# EAGLE design power_node (EAGLE 6.5.0)
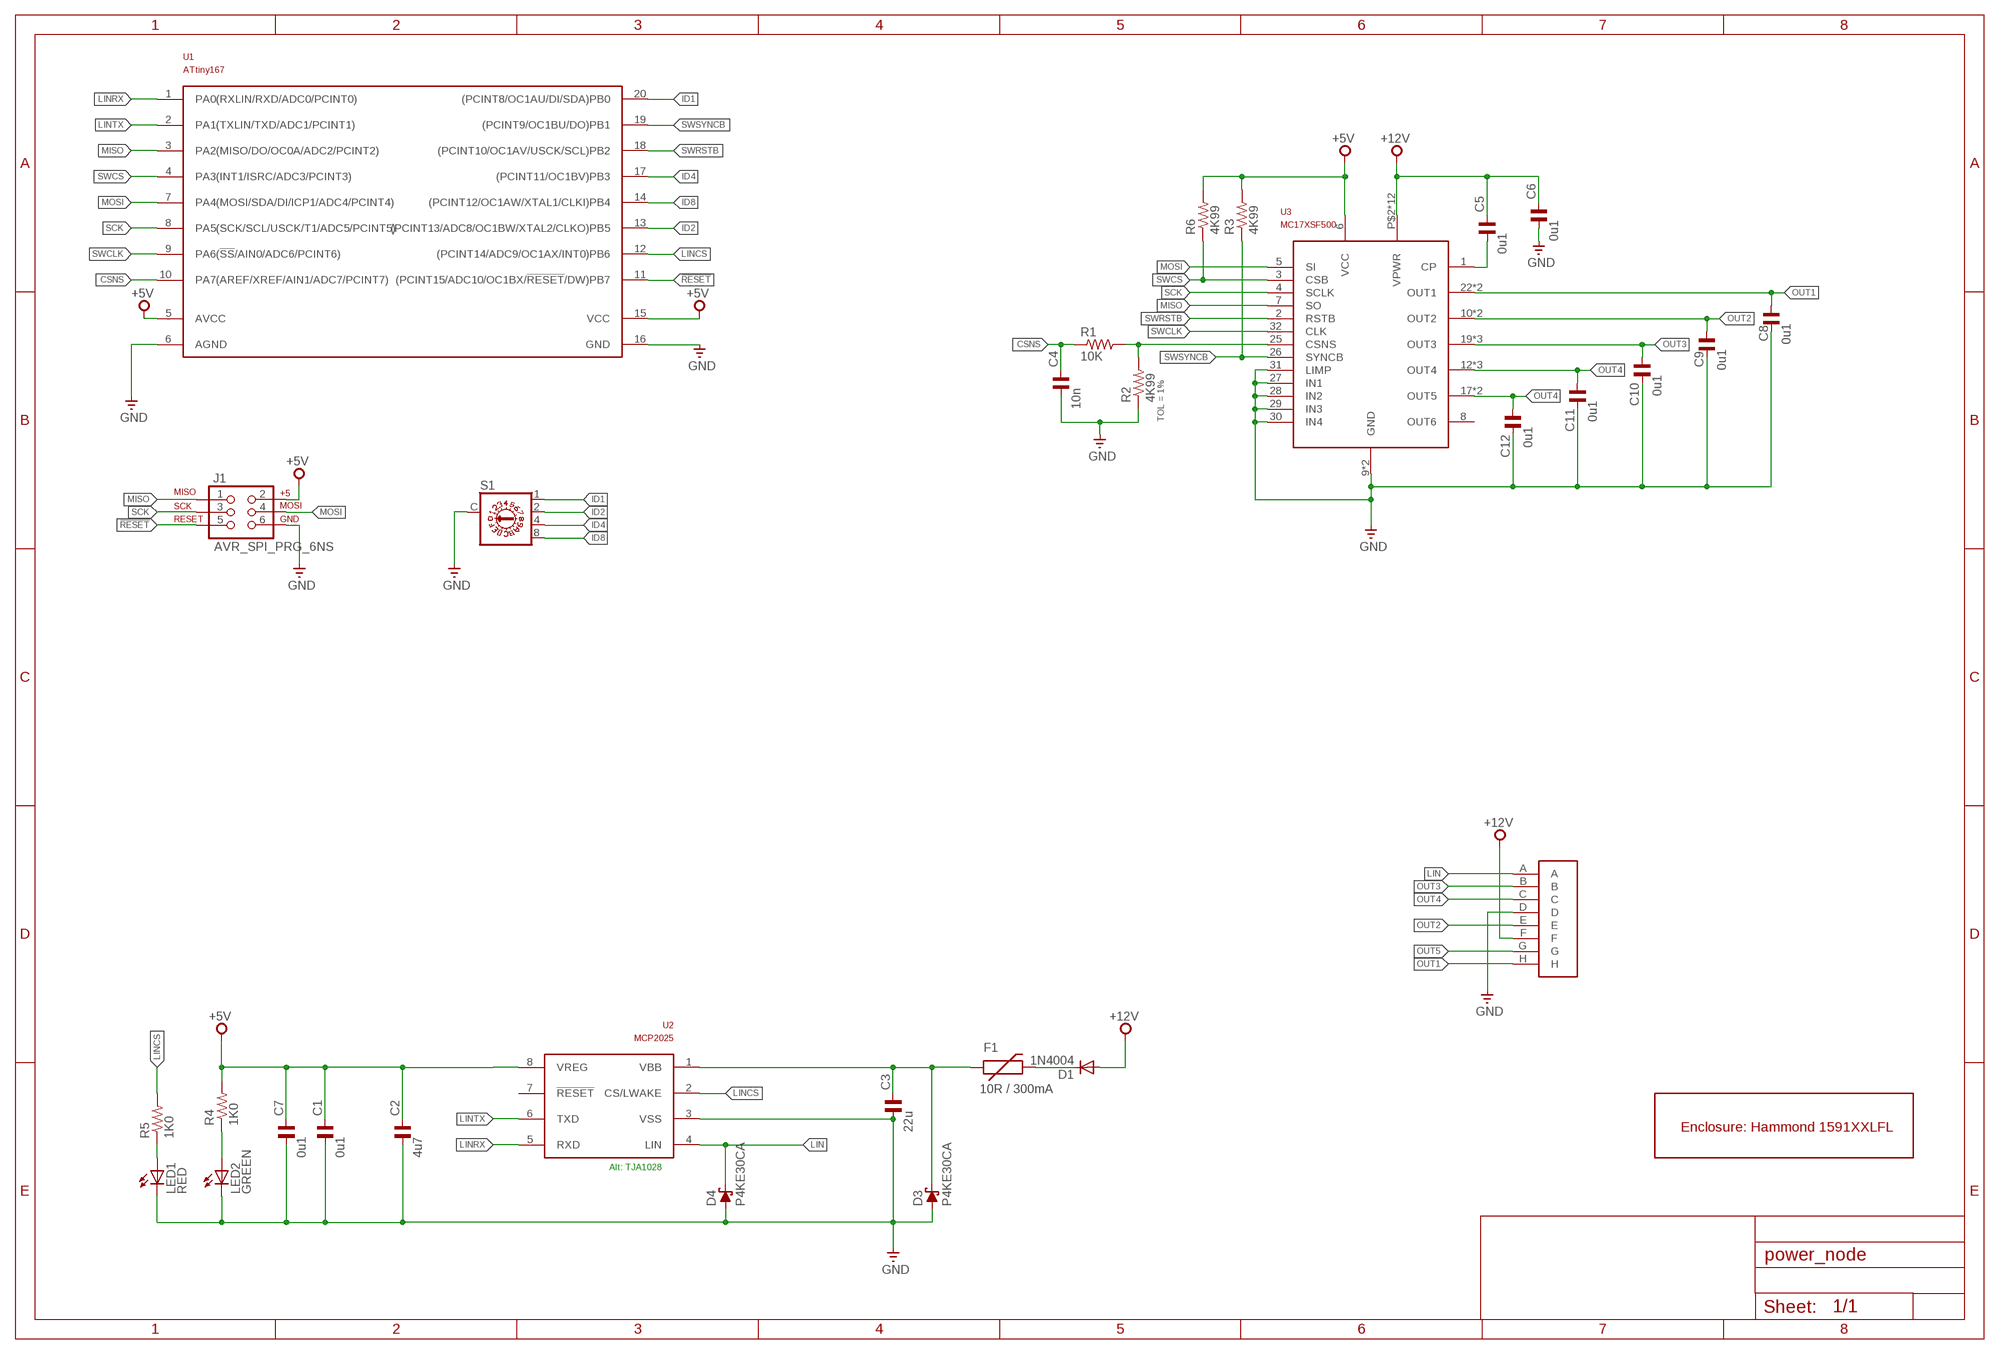
[diagram p0: schematic, sheet 1]

## Parts
C1  0u1  C-EU050-024X044  [C050-024X044]
C2  4u7  C-EU050-024X044  [C050-024X044]
C3  22u  C-EU050-024X044  [C050-024X044]
C4  10n  C-EU025-024X044  [C025-024X044]
C5  0u1  C-EU050-024X044  [C050-024X044]
C6  0u1  C-EU050-024X044  [C050-024X044]
C7  0u1  C-EU050-024X044  [C050-024X044]
C8  0u1  C-EUC0603K  [C0603K]
C9  0u1  C-EUC0603K  [C0603K]
C10  0u1  C-EUC0603K  [C0603K]
C11  0u1  C-EUC0603K  [C0603K]
C12  0u1  C-EUC0603K  [C0603K]
D1  1N4004  [DO41-10]
D3  P4KE30CA  P4KEXX  [DO41-10]
D4  P4KE30CA  P4KEXX  [DO41-10]
F1  10R / 300mA  PTCPTH  [PTC]
J1  AVR_SPI_PRG_6NS  [2X3-NS]
J2  12146734  [12146734]
LED1  RED  LED3MM  [LED3MM]
LED2  GREEN  LED3MM  [LED3MM]
R1  10K  R-EU_0207/10  [0207/10]
R2  4K99  R-EU_0207/10  [0207/10]
R3  4K99  R-EU_0207/10  [0207/10]
R4  1K0  R-EU_0207/10  [0207/10]
R5  1K0  R-EU_0207/10  [0207/10]
R6  4K99  R-EU_0207/10  [0207/10]
S1  P103  [P103]
U1  ATtiny167  ATTINY167  [SO20W]
U2  MCP2025  [SO08]
U3  MC17XSF500  [SOIC32W-EP]
U$1  1591XXLFL  [1591XXLFL]

## Nets
!RESET: J1.5 U1.11((PCINT15/ADC10/OC1BX/!RESET!/DW)PB7)
+5V [power]: C1.1 C2.1 C7.1 J1.2 R3.2 R4.2 R6.2 U1.5(AVCC) U1.15(VCC) U2.8(VREG) U3.6(VCC)
+12V [power]: C5.1 C6.1 D1.A J2.F U3.P$2(VPWR) U3.P$3(VPWR) U3.P$4(VPWR) U3.P$5(VPWR) U3.P$6(VPWR) U3.P$7(VPWR) U3.P$8(VPWR) U3.P$9(VPWR) U3.P$10(VPWR) U3.P$11(VPWR) U3.P$12(VPWR) U3.P$13(VPWR)
CSNS: C4.1 R1.1 U1.10(PA7(AREF/XREF/AIN1/ADC7/PCINT7))
GND [power]: C1.2 C2.2 C3.2 C4.2 C6.2 C7.2 C8.2 C9.2 C10.2 C11.2 C12.2 D3.A D4.A J1.6 J2.D LED1.K(C) LED2.K(C) R2.1 S1.C U1.6(AGND) U1.16(GND) U2.3(VSS) U3.9(GND) U3.24(GND) U3.27(IN1) U3.28(IN2) U3.29(IN3) U3.30(IN4) U3.31(LIMP)
ID1: S1.1 U1.20((PCINT8/OC1AU/DI/SDA)PB0)
ID2: S1.2 U1.13((PCINT13/ADC8/OC1BW/XTAL2/CLKO)PB5)
ID4: S1.4 U1.17((PCINT11/OC1BV)PB3)
ID8: S1.8 U1.14((PCINT12/OC1AW/XTAL1/CLKI)PB4)
LIN: D4.C J2.A U2.4(LIN)
LINCS: R5.2 U1.12((PCINT14/ADC9/OC1AX/INT0)PB6) U2.2(CS/LWAKE)
LINRX: U1.1(PA0(RXLIN/RXD/ADC0/PCINT0)) U2.5(RXD)
LINTX: U1.2(PA1(TXLIN/TXD/ADC1/PCINT1)) U2.6(TXD)
MISO: J1.1 U1.3(PA2(MISO/DO/OC0A/ADC2/PCINT2)) U3.7(SO)
MOSI: J1.4 U1.7(PA4(MOSI/SDA/DI/ICP1/ADC4/PCINT4)) U3.5(SI)
N$1: C5.2 U3.1(CP)
N$2 [power]: C3.1 D3.C F1.P$1 U2.1(VBB)
N$3: LED1.A R5.1
N$4: LED2.A R4.1
N$5 [power]: D1.C F1.P$2
N$6: R1.2 R2.2 U3.25(CSNS)
OUT1: C8.1 J2.H U3.22(OUT1) U3.23(OUT1)
OUT2: C9.1 J2.E U3.10(OUT2) U3.11(OUT2)
OUT3: C10.1 J2.B U3.19(OUT3) U3.20(OUT3) U3.21(OUT3)
OUT4: C11.1 J2.C U3.12(OUT4) U3.13(OUT4) U3.14(OUT4)
OUT5: C12.1 J2.G U3.17(OUT5) U3.18(OUT5)
SCK: J1.3 U1.8(PA5(SCK/SCL/USCK/T1/ADC5/PCINT5)) U3.4(SCLK)
SWCLK: U1.9(PA6(!SS!/AIN0/ADC6/PCINT6)) U3.32(CLK)
SWCS: R6.1 U1.4(PA3(INT1/ISRC/ADC3/PCINT3)) U3.3(CSB)
SWRSTB: U1.18((PCINT10/OC1AV/USCK/SCL)PB2) U3.2(RSTB)
SWSYNCB: R3.1 U1.19((PCINT9/OC1BU/DO)PB1) U3.26(SYNCB)
Unconnected: U2.7(!RESET) U3.8(OUT6)

## Notes on the sheet
- Alt: TJA1028

## Library data of the parts
C1 C5-C7 = custom:C-EU: CAPACITOR, European symbol; PARTNO: FK28X7R1H104K
C2 = custom:C-EU: CAPACITOR, European symbol; PARTNO: FK28X5R0J475K
C3 = custom:C-EU: CAPACITOR, European symbol; PARTNO: FK22X5R1E226M
C4 = custom:C-EU: CAPACITOR, European symbol; PARTNO: FK18X7R1H103K
C8-C12 = custom:C-EU: CAPACITOR, European symbol; PARTNO: C1608X7R1H104M080AA
D1 = custom:1N4004: DIODE general purpose rectifier, 1 A; PARTNO: 1N4004-TP
D3 D4 = custom:P4KEXX: DIODE transient-voltage suppressor; PARTNO: P4KE30CA
F1 = custom:PTC: Resettable Fuse PTC Resettable Fuse. Spark Fun Electronics SKU : COM-08357; PARTNO: CMF-RL10-0
J1 = custom:AVR_SPI_PRG_6: AVR ISP 6 Pin This is the reduced ISP connector for AVR programming. Common on Arduino. This footprint will take up less PCB space and can be used with a 10-pin to 6-pin adapter such as SKU: BOB-08508
J2 = custom:12146734; PARTNO: 12146724-B
LED1 = custom:LED: LEDs Standard schematic elements and footprints for 5mm, 3mm, 1206, and 0603 sized LEDs. 5mm - Spark Fun Electronics SKU : COM-00529 (and others); PARTNO: C4SMF-RJS-CT0W0BB2
LED2 = custom:LED: LEDs Standard schematic elements and footprints for 5mm, 3mm, 1206, and 0603 sized LEDs. 5mm - Spark Fun Electronics SKU : COM-00529 (and others); PARTNO: C4SMF-GJS-CV0Y0792
R1 = custom:R-EU_: RESISTOR, European symbol; PARTNO: CF14JT10K0
R2 = custom:R-EU_: RESISTOR, European symbol; PARTNO: MFR-25FBF52-4K99; TOL: 1%
R3 R6 = custom:R-EU_: RESISTOR, European symbol; PARTNO: MFR-25FBF52-4K99
R4 R5 = custom:R-EU_: RESISTOR, European symbol; PARTNO: CF14JT1K00
S1 = custom:P103: DIL/CODE SWITCH; PARTNO: SH-7050MC
U1 = custom:ATTINY167; PARTNO: ATTINY167-SU
U2 = custom:MCP2025: LIN Transceiver with Voltage Regulator; PARTNO: MCP2025-500E/SN
U3 = custom:MC17XSF500; PARTNO: MC17XSF500EK
U$1 = custom:1591XXLFL; PARTNO: 1591XXLFLBK

## Net classes
0 default: width 0.381 mm
1 power: width 0.635 mm

## Board
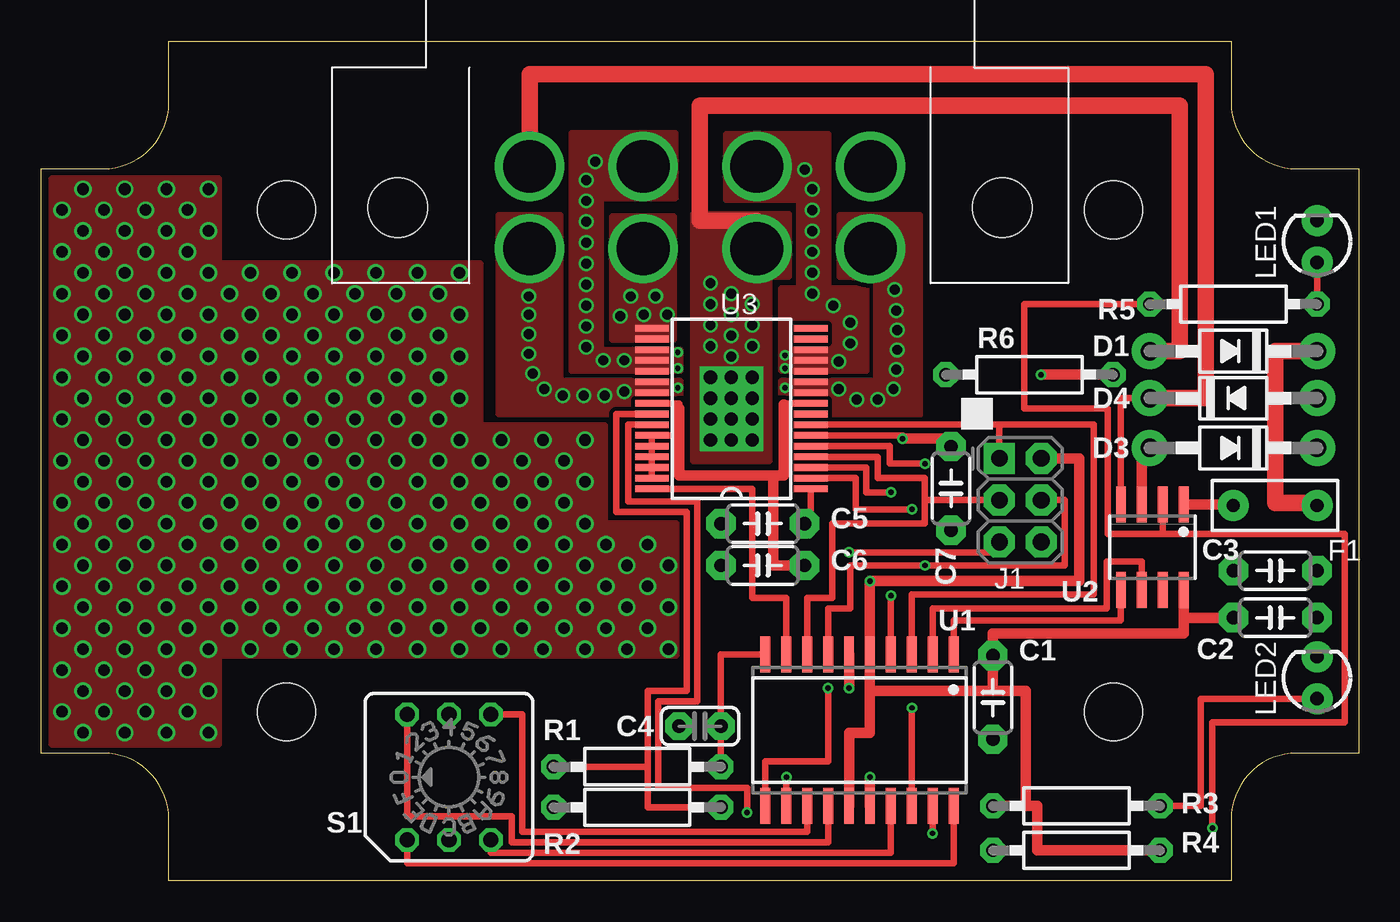
[diagram p1: board, top side]
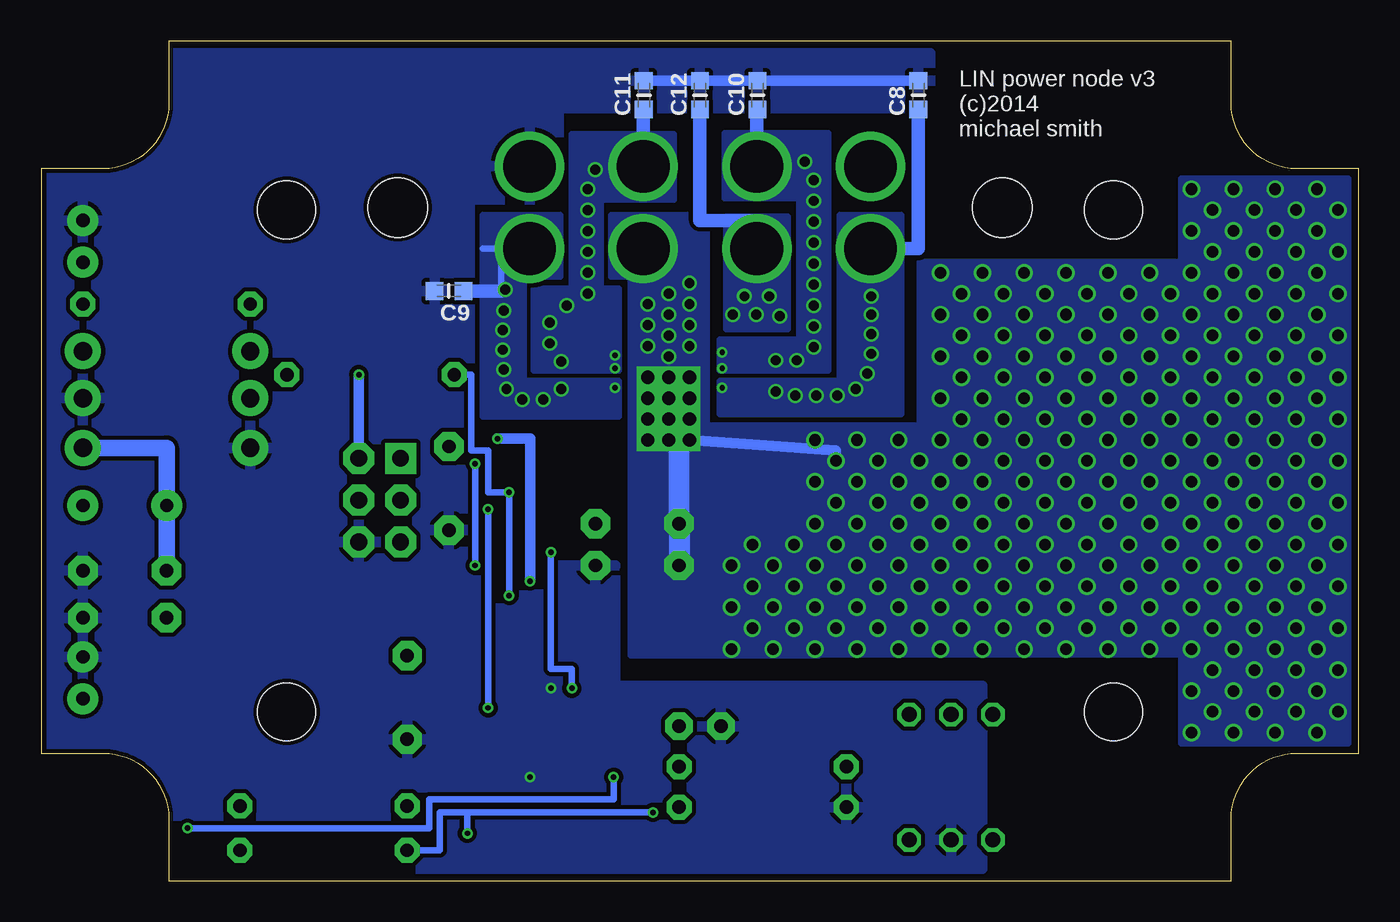
[diagram p2: board, bottom side, seen from below]

Size 80 x 51 mm. Coordinates in mm from the lower left corner, seen from the top.
Copper layers (1*16): Top 0.035mm / dielectric 1.5mm / Bottom 0.035mm
Design rules "dirt_cheap_dirty_boards.v1": minimum track width 5mil, minimum drill 12mil, track to track 5mil, track to pad 5mil, pad to pad 5mil, via to via 5mil, smd to smd 0mil, copper to edge 10mil, drill to drill 10mil, minimum pad ring 10mil, minimum via ring 6mil, stop-mask expansion 2mil, vias tented up to drill 25mil, thermal gap 10mil

### Footprints (pad centres in the part's own frame; a part is rotated, then mirrored left to right if it is on the bottom)
C050-024X044 = drill 0.813 pad 1.778 octagon: 1 -2.54,0; 2 2.54,0
C025-024X044 = drill 0.813 pad 1.676 octagon: 1 -1.27,0; 2 1.27,0
C0603K = smd 1.05 x 1.08: 1 -0.875,0; 2 0.875,0
DO41-10 = drill 1.118 pad 2.184: A 5.08,0; C -5.08,0
PTC = drill 0.8 pad 1.88: P$1 -2.54,0; P$2 2.54,0
2X3-NS = drill 1.016 pad 1.88 square: 1 -2.54,-1.27 | drill 1.016 pad 1.88 octagon: 2 -2.54,1.27; 3 0,-1.27; 4 0,1.27; 5 2.54,-1.27; 6 2.54,1.27
12146734 = drill 3.2: A 10.35,-2.5; B 3.45,-2.5; C -3.45,-2.5; D -10.35,-2.5; E -10.35,2.5; F -3.45,2.5; G 3.45,2.5; H 10.35,2.5 | hole 3.6: 18.35,0; -18.35,0
LED3MM = drill 0.813 pad 1.88: A -1.27,0; K 1.27,0
0207/10 = drill 0.813 pad 1.524 octagon: 1 -5.08,0; 2 5.08,0
P103 = drill 0.914 octagon: 1 3.81,-2.54; 2 -3.81,2.54; 4 3.81,2.54; 8 -3.81,-2.54; C 3.81,0; C1 -3.81,0
SO20W = smd 0.6 x 2.2: 1 -5.715,-4.6; 2 -4.445,-4.6; 3 -3.175,-4.6; 4 -1.905,-4.6; 5 -0.635,-4.6; 6 0.635,-4.6; 7 1.905,-4.6; 8 3.175,-4.6; 9 4.445,-4.6; 10 5.715,-4.6; 11 5.715,4.6; 12 4.445,4.6; 13 3.175,4.6; 14 1.905,4.6; 15 0.635,4.6; 16 -0.635,4.6; 17 -1.905,4.6; 18 -3.175,4.6; 19 -4.445,4.6; 20 -5.715,4.6
SO08 = smd 0.6 x 2.2: 1 -1.905,-2.6; 2 -0.635,-2.6; 3 0.635,-2.6; 4 1.905,-2.6; 5 1.905,2.6; 6 0.635,2.6; 7 -0.635,2.6; 8 -1.905,2.6
SOIC32W-EP = smd 2.05 x 0.4: 1 -4.825,4.875; 2 -4.825,4.225; 3 -4.825,3.575; 4 -4.825,2.925; 5 -4.825,2.275; 6 -4.825,1.625; 7 -4.825,0.975; 8 -4.825,0.325; 9 -4.825,-0.325; 10 -4.825,-0.975; 11 -4.825,-1.625; 12 -4.825,-2.275; 13 -4.825,-2.925; 14 -4.825,-3.575; 15 -4.825,-4.225; 16 -4.825,-4.875; 17 4.825,-4.875; 18 4.825,-4.225; 19 4.825,-3.575; 20 4.825,-2.925; 21 4.825,-2.275; 22 4.825,-1.625; 23 4.825,-0.975; 24 4.825,-0.325; 25 4.825,0.325; 26 4.825,0.975; 27 4.825,1.625; 28 4.825,2.275; 29 4.825,2.925; 30 4.825,3.575; 31 4.825,4.225; 32 4.825,4.875 | drill 0.8 square: P$2 1.27,1.905; P$3 0,1.905; P$4 -1.27,1.905; P$5 1.27,0.635; P$6 0,0.635; P$7 -1.27,0.635; P$8 1.27,-0.635; P$9 0,-0.635; P$10 -1.27,-0.635; P$11 1.27,-1.905; P$12 0,-1.905; P$13 -1.27,-1.905
1591XXLFL = hole 3.5: -25.1,15.25; 25.1,15.25; -25.1,-15.25; 25.1,-15.25

### Placement (x,y rotation side)
C1  57.78,11.13 270 top
C2  74.92,15.98 0 top
C3  74.92,18.83 0 top
C4  40,9.39 180 top
C5  43.81,21.69 0 top
C6  43.81,19.15 0 top
C7  55.24,23.83 270 top
C8  26.74,47.73 90 bottom
C9  55.24,35.82 180 bottom
C10  36.51,47.73 90 bottom
C11  43.41,47.73 90 bottom
C12  40,47.73 90 bottom
D1  72.39,32.17 180 top
D3  72.39,26.29 180 top
D4  72.39,29.31 0 top
F1  74.92,22.8 0 top
J1  59.45,23.12 270 top
J2  40,40.9 180 top
LED1  77.47,38.84 90 top
LED2  77.47,12.32 90 top
R1  36.19,6.93 180 top
R2  36.19,4.47 0 top
R3  62.86,1.85 0 top
R4  62.86,4.54 180 top
R5  72.39,35.02 180 top
R6  60,30.74 0 top
S1  24.76,6.29 270 top
U1  49.68,9.15 180 top
U2  67.46,20.26 180 top
U3  41.91,28.67 180 top
U$1  40,25.5 0 top

### Tracks (layer width: path | path; a pad name or v marks a point on that pad's centre or on a via)
!RESET  (via drill 0.33)
  Top 0.381: v49.05,19.94 58.18,19.94 J1.5 | U1.11 43.97,7.24 47.78,7.24 v47.78,11.69
  Bottom 0.381: v47.78,11.69 47.78,12.88 49.05,12.88 v49.05,19.94
+5V  (via drill 0.33)
  Top 0.406: U3.6 52.3,27.05 v52.3,26.85
  Top 0.635: U1.15 49.05,8.99 50.32,8.99 50.32,11.53 | 50.32,11.53 U1.5 v50.32,18.2 63.02,18.2 63.02,25.66 J1.2 | 57.78,11.53 C1.1 57.78,15.02 69.37,15.02 69.37,15.98 | 57.78,11.53 50.32,11.53 | 69.37,15.98 U2.8 | C2.1 69.37,15.98 | R3.2 60.48,1.85 60.48,4.54 | 60.48,4.54 59.76,4.54 59.76,11.53 57.78,11.53 | R4.2 60.48,4.54 | v60.72,30.74 R6.2 | C7.1 55.24,26.85 v52.3,26.85
  Bottom 0.635: v52.3,26.85 50.32,26.85 v50.32,18.2 | v60.72,30.74 J1.2
+12V  (via drill 0.6, 0.7)
  Top 1.016: D1.A 69.13,32.17 69.13,47.09 40,47.09 40,40.1 43.45,40.1 J2.F
  Bottom 0.635: v31.74,25.5 31.74,26.13 U3.P$2
  Bottom 1.27: C6.1 C5.1 41.27,26.77 U3.P$3
  other vias: 22.86,34.39 21.59,33.12 22.86,31.85 21.59,30.58 22.86,29.31 21.59,28.04 22.86,26.77 22.86,24.23 22.86,21.69 21.59,25.5 21.59,22.96 7.62,34.39 6.35,33.12 7.62,31.85 6.35,30.58 7.62,29.31 6.35,28.04 7.62,26.77 7.62,24.23 7.62,21.69 6.35,25.5 6.35,22.96 5.07,11.53 5.07,8.99 3.8,12.8 3.8,10.26 15.23,34.39 13.96,33.12 15.23,31.85 13.96,30.58 15.23,29.31 13.96,28.04 15.23,26.77 15.23,24.23 15.23,21.69 13.96,25.5 13.96,22.96 10.16,19.15 10.16,16.61 10.16,14.07 8.89,17.88 8.89,15.34 2.54,36.93 2.54,39.47 3.8,35.66 3.8,38.2 5.07,36.93 5.07,39.47 6.35,35.66 6.35,38.2 7.62,36.93 7.62,39.47 8.89,35.66 8.89,38.2 1.27,35.66 1.27,38.2 2.54,34.39 1.27,33.12 2.54,31.85 1.27,30.58 2.54,29.31 1.27,28.04 2.54,26.77 2.54,24.23 2.54,21.69 1.27,25.5 1.27,22.96 5.07,34.39 3.8,33.12 5.07,31.85 3.8,30.58 5.07,29.31 3.8,28.04 5.07,26.77 5.07,24.23 5.07,21.69 3.8,25.5 3.8,22.96 3.8,20.42 1.27,20.42 2.54,19.15 2.54,16.61 2.54,14.07 1.27,17.88 1.27,15.34 2.54,11.53 2.54,8.99 1.27,12.8 1.27,10.26 7.62,11.53 7.62,8.99 6.35,12.8 6.35,10.26 8.89,12.8 8.89,10.26 7.62,19.15 7.62,16.61 7.62,14.07 6.35,17.88 6.35,15.34 5.07,19.15 5.07,16.61 5.07,14.07 3.8,17.88 3.8,15.34 6.35,20.42 8.89,20.42 10.16,34.39 8.89,33.12 10.16,31.85 8.89,30.58 10.16,29.31 8.89,28.04 10.16,26.77 10.16,24.23 10.16,21.69 8.89,25.5 8.89,22.96 12.7,34.39 11.43,33.12 12.7,31.85 11.43,30.58 12.7,29.31 11.43,28.04 12.7,26.77 12.7,24.23 12.7,21.69 11.43,25.5 11.43,22.96 12.7,19.15 12.7,16.61 12.7,14.07 11.43,17.88 11.43,15.34 11.43,20.42 13.96,20.42 15.23,19.15 15.23,16.61 15.23,14.07 13.96,17.88 13.96,15.34 17.77,19.15 17.77,16.61 17.77,14.07 16.5,17.88 16.5,15.34 20.32,19.15 20.32,16.61 20.32,14.07 19.05,17.88 19.05,15.34 17.77,34.39 16.5,33.12 17.77,31.85 16.5,30.58 17.77,29.31 16.5,28.04 17.77,26.77 17.77,24.23 17.77,21.69 16.5,25.5 16.5,22.96 16.5,20.42 19.05,20.42 20.32,34.39 19.05,33.12 20.32,31.85 19.05,30.58 20.32,29.31 19.05,28.04 20.32,26.77 20.32,24.23 20.32,21.69 19.05,25.5 19.05,22.96 8.89,40.74 6.35,40.74 3.8,40.74 1.27,40.74 24.12,33.12 24.12,30.58 24.12,28.04 24.12,25.5 24.12,22.96 25.4,21.69 25.4,24.23 25.4,26.77 25.4,29.31 25.4,31.85 25.4,34.39 21.59,20.42 21.59,17.88 22.86,19.15 22.86,16.61 21.59,15.34 22.86,14.07 26.66,22.96 27.94,24.23 27.94,21.69 24.12,20.42 24.12,17.88 24.12,15.34 26.66,25.5 29.2,25.5 30.48,24.23 30.48,21.69 29.2,22.96 31.74,22.96 31.74,20.42 30.48,19.15 31.74,17.88 30.48,16.61 31.74,15.34 30.48,14.07 29.2,20.42 29.2,17.88 29.2,15.34 27.94,14.07 27.94,16.61 27.94,19.15 26.66,20.42 25.4,19.15 26.66,17.88 26.66,15.34 25.4,16.61 25.4,14.07 27.94,26.77 30.48,26.77 33.02,19.15 2.54,42.01 5.07,42.01 7.62,42.01 10.16,36.93 10.16,39.47 10.16,42.01 10.16,11.53 10.16,8.99 33.02,21.69 33.02,24.23 33.02,26.77 11.43,35.66 13.96,35.66 16.5,35.66 19.05,35.66 21.59,35.66 24.12,35.66 12.7,36.93 15.23,36.93 17.77,36.93 20.32,36.93 22.86,36.93 25.4,36.93 33.02,16.61 33.02,14.07 34.28,20.42 34.28,17.88 35.55,19.15 36.83,20.42 38.09,19.15 36.83,17.88 38.09,16.61 35.55,16.61 36.83,15.34 34.28,15.34 35.55,14.07 38.09,14.07 41.91,31.85 41.91,33.12 41.91,34.39 41.91,35.66 40.63,32.48 43.17,32.48 43.17,33.76 43.17,35.02 40.63,33.76 40.63,35.02 40.63,36.3
  pour Bottom (isolate 0.305, no thermals): 10.79,42.65 0.63,42.65 0.63,8.36 10.79,8.36 10.79,13.75 33.25,13.75 33.25,27.64 26.66,27.64 26.66,37.56 10.79,37.56
  pour Top (isolate 0.254, no thermals): 44.21,25.5 44.21,36.69 45.4,36.69 45.4,40.5 39.6,40.5 39.6,25.5
  pour Bottom (isolate 0.254, no thermals): 45.4,40.42 39.6,40.42 39.6,27.64 32.78,27.64 32.78,13.67 44.21,13.67 44.21,36.69 45.4,36.69
  pour Top (isolate 0.254, no thermals): 0.63,8.28 10.79,8.28 10.79,13.67 38.57,13.67 38.57,21.69 34.21,21.69 34.21,27.64 26.66,27.64 26.66,37.49 10.79,37.49 10.79,42.65 0.63,42.65
CSNS
  Top 0.381: R1.1 C4.1 41.27,13.75 U1.10
GND  (via drill 0.33)
  Top 0.406: U3.31 U3.30 U3.29 U3.28 U3.27 38.73,27.05 38.73,26.77 | U3.24 38.73,29 38.73,28.67 | U3.9 45.08,29 45.08,28.91
  Top 0.635: U1.6 v49.05,11.69 | U1.16 v50.32,6.29 | U2.3 66.83,26.29 D3.A | 38.73,28.67 38.73,26.77 38.73,24.63 44.45,24.63 | 45.08,28.91 45.08,24.63 44.45,24.63 | 44.45,24.63 44.45,19.15 C6.2
  Bottom 0.635: C8.2 C10.2 C12.2 C11.2
  pour Bottom (isolate 0.254): 79.37,50.27 79.37,0.73 22.86,0.73 22.86,11.85 45.16,11.85 45.16,19.15 53.97,19.15 53.97,41.38 48.57,41.38 48.57,46.93 26.03,46.93 26.03,50.27
ID1
  Top 0.381: S1.1 22.22,1.05 51.59,1.05 55.4,1.05 U1.20
ID2
  Top 0.381: S1.2 29.2,10.1 29.2,2.96 46.51,2.96 U1.13
ID4
  Top 0.381: S1.4 27.3,1.69 47.78,1.69 51.59,1.69 U1.17
ID8
  Top 0.381: S1.8 22.22,3.91 28.57,3.91 28.57,2.32 46.51,2.32 47.78,2.32 U1.14
LIN
  Top 0.381: D4.C 65.56,29.31 U2.4
  Top 1.016: J2.A 29.65,48.99 70.72,48.99 70.72,29.31 D4.C
LINCS  (via drill 0.33)
  Top 0.381: 68.1,21.05 68.58,21.05 79.13,21.05 79.13,9.62 71.11,9.62 v71.11,3.2 | 68.1,21.05 U2.2 | R5.2 59.69,35.02 59.69,28.67 64.77,28.67 64.77,21.05 68.1,21.05 | U1.12 v45.24,6.29
  Bottom 0.381: v45.24,6.29 45.24,4.94 56.43,4.94 56.43,3.2 v71.11,3.2
LINRX
  Top 0.381: U2.5 65.56,15.82 55.4,15.82 U1.1
LINTX
  Top 0.381: U2.6 66.83,19.39 64.69,19.39 64.69,16.53 54.13,16.53 U1.2
MISO
  Top 0.381: U1.3 52.86,17.4 63.89,17.4 63.89,27.7 58.18,27.7 | 58.18,27.7 J1.1 | U3.7 58.18,27.7
MOSI  (via drill 0.33)
  Top 0.381: J1.4 62.15,23.12 62.15,19.15 v53.65,19.15 49.13,19.15 49.13,16.53 47.78,16.53 U1.7 | U3.5 51.51,26.4 51.51,25.34 v53.65,25.34
  Bottom 0.381: v53.65,25.34 v53.65,19.15
N$1
  Top 0.381: U3.1 46.73,21.69 C5.2
N$2
  Top 0.635: F1.P$1 72.39,22.86 U2.1
  Bottom 1.016: D3.C 72.39,26.29 F1.P$1 C3.1
N$3
  Top 0.381: R5.1 LED1.A
N$4
  Top 0.381: R4.1 70.4,4.54 70.4,11.05 LED2.A
N$5
  Top 0.635: F1.P$2 77.47,22.96
  Top 1.016: 77.47,22.96 74.92,22.96 74.92,32.17 D1.C
N$6
  Top 0.381: U3.25 34.92,28.35 34.92,22.4 39.21,22.4 39.21,11.53 36.83,11.53 36.83,6.93 | R1.2 36.83,6.93 | R2.2 36.83,4.47 36.83,6.93
OUT1  (via drill 0.33, 0.6)
  Bottom 0.813: C8.1 26.74,38.4 J2.H
  other vias: 38.65,29.95 35.4,29.71 34.21,29.47 32.94,29.47 31.67,29.47 30.55,29.87 29.84,30.82 29.6,32.01 29.6,33.2 29.6,34.39 29.6,35.5
  pour Top (isolate 0.254, no thermals): 38.81,30.34 31.51,30.34 31.51,40.42 27.78,40.42 27.78,28.36 38.81,28.36
  pour Bottom (isolate 0.254, no thermals): 38.81,30.34 31.51,30.34 31.51,40.42 27.78,40.42 27.78,28.36 38.81,28.36
OUT2  (via drill 0.33, 0.6)
  Bottom 0.381: 53.18,38.4 52.06,38.4 | 52.06,38.4 J2.E | 52.06,35.82 52.06,38.4
  Bottom 0.813: C9.1 52.06,35.82
  other vias: 45.16,29.95 48.41,29.87 49.52,29.23 50.8,29.23 51.75,29.87 51.91,31.06 51.99,32.25 51.99,33.44 51.91,34.63 51.83,35.9
  pour Top (isolate 0.254, no thermals): 44.92,28.28 53.34,28.28 53.34,40.42 48.49,40.42 48.49,36.69 50.72,36.61 50.72,30.34 44.92,30.34
  pour Bottom (isolate 0.254, no thermals): 44.92,28.2 53.18,28.2 53.18,40.42 48.49,40.42 48.49,36.69 50.72,36.69 50.72,30.34 44.92,30.34
OUT3  (via drill 0.33, 0.6)
  Bottom 0.381: C10.1 36.55,46.85
  Bottom 0.813: 36.55,46.85 J2.B
  other vias: 38.65,31.14 38.65,32.09 35.4,31.61 34.13,31.61 33.09,32.41 33.09,33.68 33.09,34.95 33.09,36.22 33.09,37.49 33.09,38.76 33.09,40.03 33.09,41.3 33.09,42.57 33.65,43.68
  pour Top (isolate 0.254, no thermals): 38.81,32.25 33.97,32.25 33.97,41.45 38.49,41.45 38.49,45.42 32.22,45.42 32.22,30.98 38.81,30.98
  pour Bottom (isolate 0.254, no thermals): 38.81,32.88 33.97,32.88 33.97,41.45 38.49,41.45 38.49,45.42 32.22,45.42 32.22,30.98 38.81,30.98
OUT4  (via drill 0.33, 0.6)
  Bottom 0.813: C11.1 43.45,46.85 J2.C
  other vias: 45.16,31.14 45.16,31.93 48.41,31.53 49.13,32.64 49.13,33.91 48.1,34.95 46.83,35.66 46.83,36.93 46.83,38.2 46.83,39.47 46.83,40.74 46.83,42.01 46.35,43.2
  pour Top (isolate 0.254, no thermals): 44.92,30.98 50.08,30.98 50.08,35.98 47.78,35.98 47.78,45.34 41.59,45.34 41.59,41.38 46.03,41.38 46.03,35.98 44.92,35.98
  pour Bottom (isolate 0.254, no thermals): 44.92,30.98 50.08,30.98 50.08,35.98 47.78,35.98 47.78,45.34 41.59,45.34 41.59,41.38 46.03,41.38 46.03,35.98 44.92,35.98
OUT5  (via drill 0.6)
  Bottom 0.381: J2.G 36.55,40.1
  Bottom 0.813: 36.55,40.1 40,40.1 C12.1
  other vias: 38.02,34.39 36.59,34.39 35.16,34.31 37.3,35.5 35.79,35.5
  pour Top (isolate 0.254, no thermals): 38.41,32.88 38.41,40.34 34.68,40.34 34.68,32.88
  pour Bottom (isolate 0.254, no thermals): 38.41,33.52 34.68,33.52 34.68,40.34 38.41,40.34
SCK
  Top 0.381: U3.4 50.8,25.75 50.8,24.47 53.65,24.47 53.65,23.12 | 53.65,23.12 J1.3 | U1.8 46.51,17.17 48.02,17.17 48.02,21.69 53.65,21.69 53.65,23.12
SWCLK
  Top 0.381: U1.9 45.24,17.17 43.17,17.17 43.17,23.8 U3.32
SWCS  (via drill 0.33)
  Top 0.381: U1.4 v51.59,17.32 | v51.59,23.59 50.08,23.59 50.08,25.1 U3.3
  Bottom 0.381: v51.59,17.32 v51.59,23.59 52.86,23.59 52.86,26.13 53.89,26.13 53.89,30.74 R6.1
SWRSTB  (via drill 0.33)
  Top 0.381: v52.86,10.5 U1.18 | U3.2 49.45,24.45 49.45,22.56 v52.86,22.56
  Bottom 0.381: v52.86,22.56 v52.86,10.5
SWSYNCB  (via drill 0.33)
  Top 0.381: U3.26 35.63,27.7 35.63,23.04 39.84,23.04 39.84,10.89 37.46,10.89 37.46,5.66 42.86,5.66 v42.86,4.15 | U1.19 v54.13,2.88
  Bottom 0.381: v42.86,4.15 54.13,4.15 | 54.13,4.15 55.8,4.15 55.8,1.85 R3.1 | v54.13,2.88 54.13,4.15

### Text on the board
bNames: LIN power node v3 / (c)2014 / michael smith